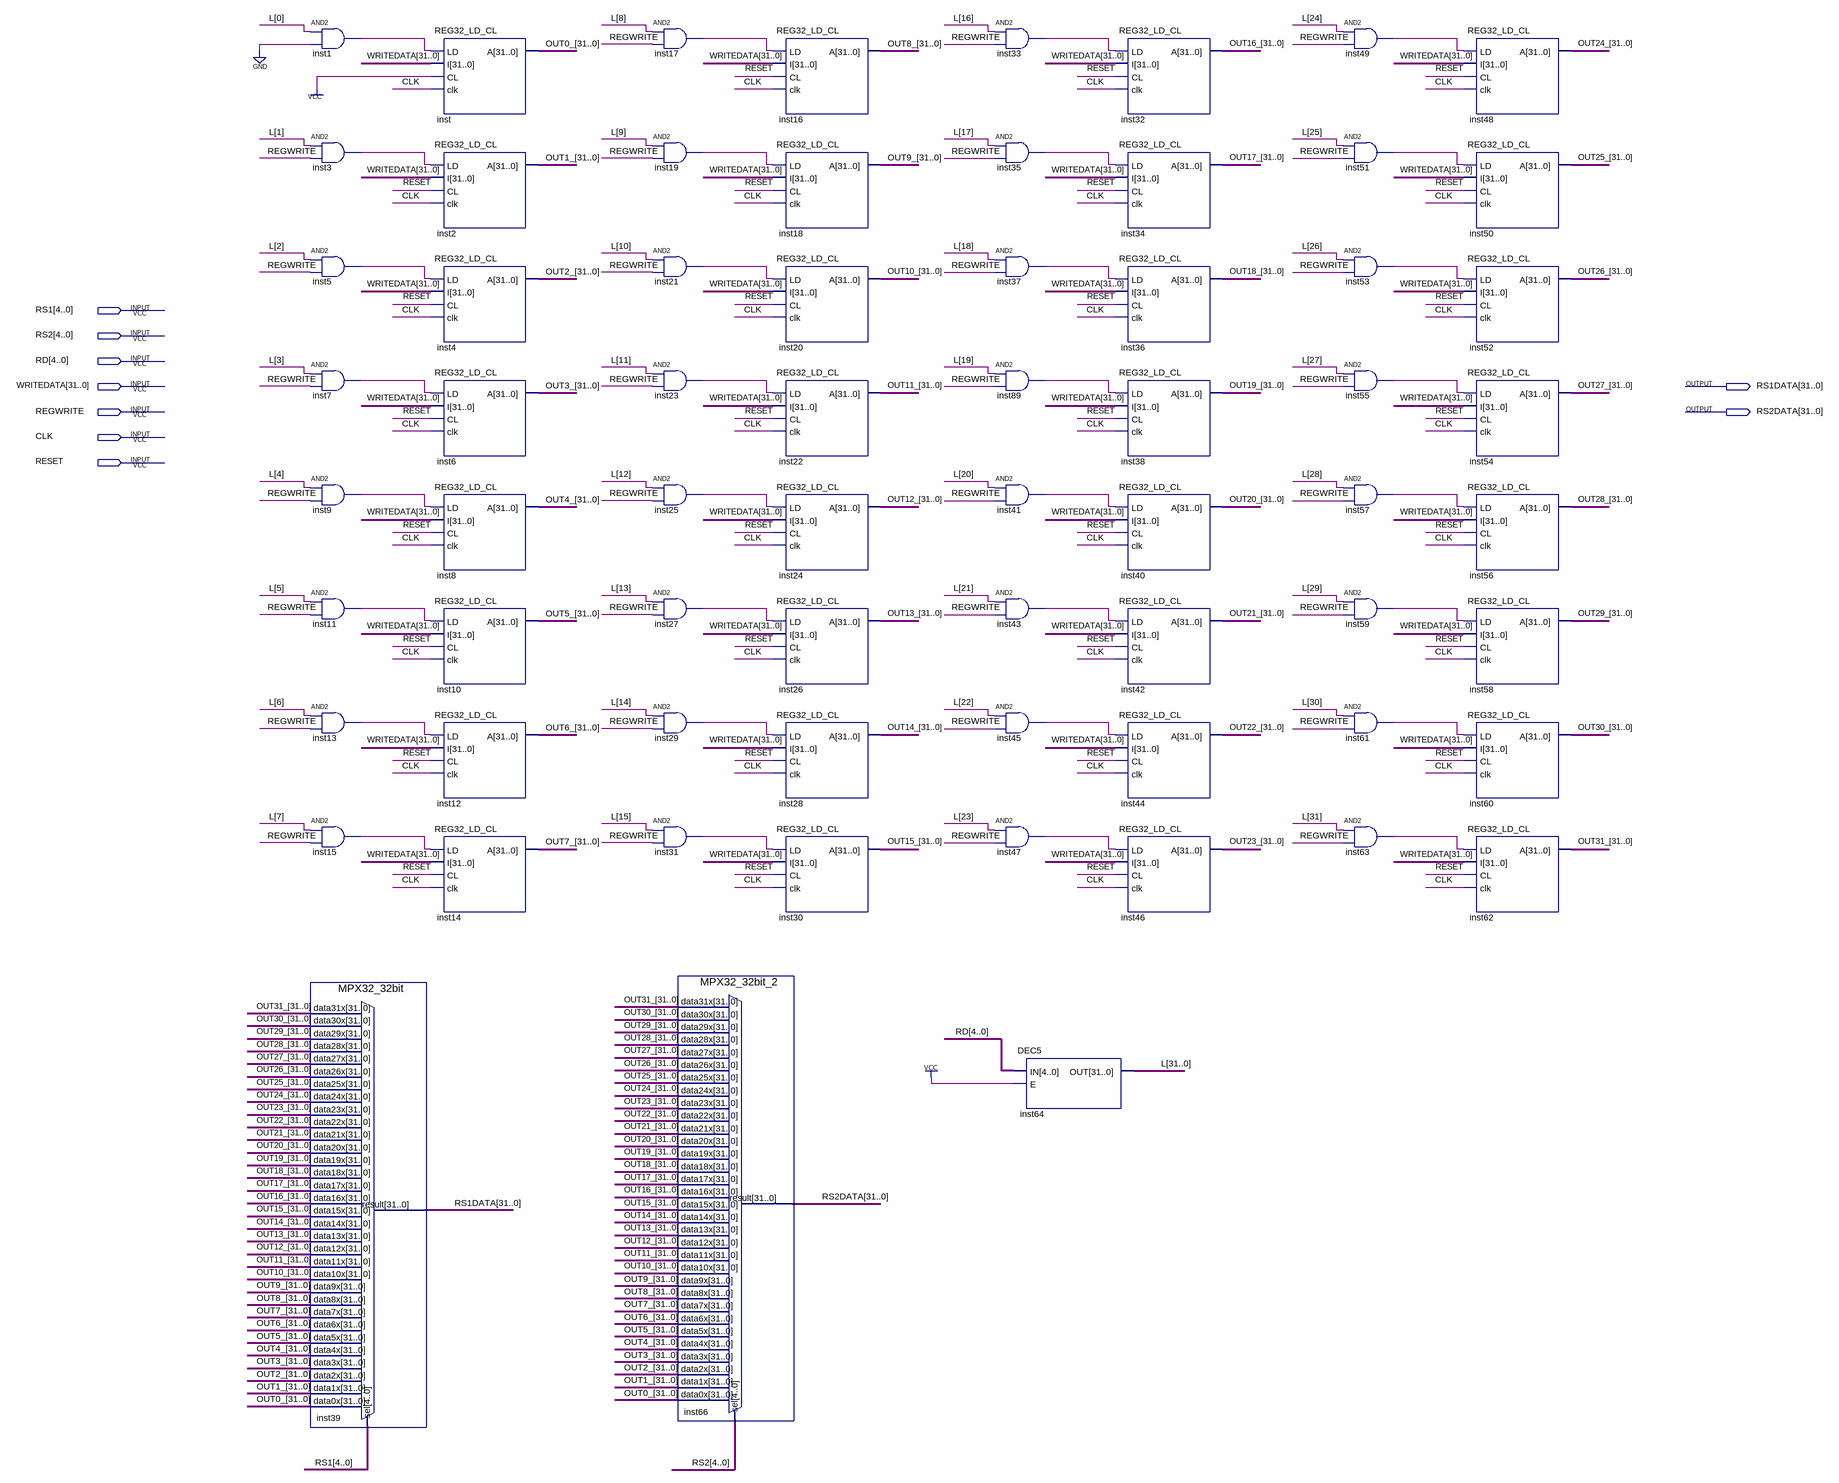
[diagram p0: schematic sheet]
// Quartus schematic REGFILE.bdf as structural Verilog: 67 symbols, 9 pins
module REGFILE (
  input  [4:0] RS1,
  input  [4:0] RS2,
  input  [4:0] RD,
  input  [31:0] WRITEDATA,
  input  REGWRITE,
  input  CLK,
  input  RESET,
  output [31:0] RS1DATA,
  output [31:0] RS2DATA
);

  wire inst1_out, inst3_out, inst5_out, inst7_out, inst9_out, inst11_out, inst13_out, inst15_out, inst17_out,
       inst19_out, inst21_out, inst23_out, inst25_out, inst27_out, inst29_out, inst31_out, inst33_out,
       inst35_out, inst37_out, inst41_out, inst43_out, inst45_out, inst47_out, inst49_out, inst51_out,
       inst53_out, inst55_out, inst57_out, inst59_out, inst61_out, inst63_out, inst89_out;
  wire [31:0] L, OUT0_, OUT1_, OUT2_, OUT3_, OUT4_, OUT5_, OUT6_, OUT7_, OUT8_, OUT9_, OUT10_, OUT11_,
       OUT12_, OUT13_, OUT14_, OUT15_, OUT16_, OUT17_, OUT18_, OUT19_, OUT20_, OUT21_, OUT22_, OUT23_,
       OUT24_, OUT25_, OUT26_, OUT27_, OUT28_, OUT29_, OUT30_, OUT31_;

  and inst1 (inst1_out, L[0], 1'b0);
  and inst3 (inst3_out, L[1], REGWRITE);
  and inst5 (inst5_out, L[2], REGWRITE);
  and inst7 (inst7_out, L[3], REGWRITE);
  and inst9 (inst9_out, L[4], REGWRITE);
  and inst11 (inst11_out, L[5], REGWRITE);
  and inst13 (inst13_out, L[6], REGWRITE);
  and inst15 (inst15_out, L[7], REGWRITE);
  MPX32_32bit inst39 (
    .data31x(OUT31_), .data30x(OUT30_), .data29x(OUT29_), .data28x(OUT28_), .data27x(OUT27_),
    .data26x(OUT26_), .data25x(OUT25_), .data24x(OUT24_), .data23x(OUT23_), .data22x(OUT22_),
    .data21x(OUT21_), .data20x(OUT20_), .data19x(OUT19_), .data18x(OUT18_), .data17x(OUT17_),
    .data16x(OUT16_), .data15x(OUT15_), .data14x(OUT14_), .data13x(OUT13_), .data12x(OUT12_),
    .data11x(OUT11_), .data10x(OUT10_), .data9x(OUT9_), .data8x(OUT8_), .data7x(OUT7_), .data6x(OUT6_),
    .data5x(OUT5_), .data4x(OUT4_), .data3x(OUT3_), .data2x(OUT2_), .data1x(OUT1_), .data0x(OUT0_),
    .sel(RS1), .result(RS1DATA));
  REG32_LD_CL inst (.LD(inst1_out), .I(WRITEDATA), .CL(1'b1), .clk(CLK), .A(OUT0_));
  REG32_LD_CL inst2 (.LD(inst3_out), .I(WRITEDATA), .CL(RESET), .clk(CLK), .A(OUT1_));
  REG32_LD_CL inst4 (.LD(inst5_out), .I(WRITEDATA), .CL(RESET), .clk(CLK), .A(OUT2_));
  REG32_LD_CL inst6 (.LD(inst7_out), .I(WRITEDATA), .CL(RESET), .clk(CLK), .A(OUT3_));
  REG32_LD_CL inst8 (.LD(inst9_out), .I(WRITEDATA), .CL(RESET), .clk(CLK), .A(OUT4_));
  REG32_LD_CL inst10 (.LD(inst11_out), .I(WRITEDATA), .CL(RESET), .clk(CLK), .A(OUT5_));
  REG32_LD_CL inst12 (.LD(inst13_out), .I(WRITEDATA), .CL(RESET), .clk(CLK), .A(OUT6_));
  REG32_LD_CL inst14 (.LD(inst15_out), .I(WRITEDATA), .CL(RESET), .clk(CLK), .A(OUT7_));
  and inst17 (inst17_out, L[8], REGWRITE);
  and inst19 (inst19_out, L[9], REGWRITE);
  and inst21 (inst21_out, L[10], REGWRITE);
  and inst23 (inst23_out, L[11], REGWRITE);
  and inst25 (inst25_out, L[12], REGWRITE);
  and inst27 (inst27_out, L[13], REGWRITE);
  and inst29 (inst29_out, L[14], REGWRITE);
  and inst31 (inst31_out, L[15], REGWRITE);
  MPX32_32bit_2 inst66 (
    .data31x(OUT31_), .data30x(OUT30_), .data29x(OUT29_), .data28x(OUT28_), .data27x(OUT27_),
    .data26x(OUT26_), .data25x(OUT25_), .data24x(OUT24_), .data23x(OUT23_), .data22x(OUT22_),
    .data21x(OUT21_), .data20x(OUT20_), .data19x(OUT19_), .data18x(OUT18_), .data17x(OUT17_),
    .data16x(OUT16_), .data15x(OUT15_), .data14x(OUT14_), .data13x(OUT13_), .data12x(OUT12_),
    .data11x(OUT11_), .data10x(OUT10_), .data9x(OUT9_), .data8x(OUT8_), .data7x(OUT7_), .data6x(OUT6_),
    .data5x(OUT5_), .data4x(OUT4_), .data3x(OUT3_), .data2x(OUT2_), .data1x(OUT1_), .data0x(OUT0_),
    .sel(RS2), .result(RS2DATA));
  REG32_LD_CL inst16 (.LD(inst17_out), .I(WRITEDATA), .CL(RESET), .clk(CLK), .A(OUT8_));
  REG32_LD_CL inst18 (.LD(inst19_out), .I(WRITEDATA), .CL(RESET), .clk(CLK), .A(OUT9_));
  REG32_LD_CL inst20 (.LD(inst21_out), .I(WRITEDATA), .CL(RESET), .clk(CLK), .A(OUT10_));
  REG32_LD_CL inst22 (.LD(inst23_out), .I(WRITEDATA), .CL(RESET), .clk(CLK), .A(OUT11_));
  REG32_LD_CL inst24 (.LD(inst25_out), .I(WRITEDATA), .CL(RESET), .clk(CLK), .A(OUT12_));
  REG32_LD_CL inst26 (.LD(inst27_out), .I(WRITEDATA), .CL(RESET), .clk(CLK), .A(OUT13_));
  REG32_LD_CL inst28 (.LD(inst29_out), .I(WRITEDATA), .CL(RESET), .clk(CLK), .A(OUT14_));
  REG32_LD_CL inst30 (.LD(inst31_out), .I(WRITEDATA), .CL(RESET), .clk(CLK), .A(OUT15_));
  and inst33 (inst33_out, L[16], REGWRITE);
  and inst35 (inst35_out, L[17], REGWRITE);
  and inst37 (inst37_out, L[18], REGWRITE);
  and inst89 (inst89_out, L[19], REGWRITE);
  and inst41 (inst41_out, L[20], REGWRITE);
  and inst43 (inst43_out, L[21], REGWRITE);
  and inst45 (inst45_out, L[22], REGWRITE);
  and inst47 (inst47_out, L[23], REGWRITE);
  DEC5 inst64 (.IN(RD), .E(1'b1), .OUT(L));
  REG32_LD_CL inst32 (.LD(inst33_out), .I(WRITEDATA), .CL(RESET), .clk(CLK), .A(OUT16_));
  REG32_LD_CL inst34 (.LD(inst35_out), .I(WRITEDATA), .CL(RESET), .clk(CLK), .A(OUT17_));
  REG32_LD_CL inst36 (.LD(inst37_out), .I(WRITEDATA), .CL(RESET), .clk(CLK), .A(OUT18_));
  REG32_LD_CL inst38 (.LD(inst89_out), .I(WRITEDATA), .CL(RESET), .clk(CLK), .A(OUT19_));
  REG32_LD_CL inst40 (.LD(inst41_out), .I(WRITEDATA), .CL(RESET), .clk(CLK), .A(OUT20_));
  REG32_LD_CL inst42 (.LD(inst43_out), .I(WRITEDATA), .CL(RESET), .clk(CLK), .A(OUT21_));
  REG32_LD_CL inst44 (.LD(inst45_out), .I(WRITEDATA), .CL(RESET), .clk(CLK), .A(OUT22_));
  REG32_LD_CL inst46 (.LD(inst47_out), .I(WRITEDATA), .CL(RESET), .clk(CLK), .A(OUT23_));
  and inst49 (inst49_out, L[24], REGWRITE);
  and inst51 (inst51_out, L[25], REGWRITE);
  and inst53 (inst53_out, L[26], REGWRITE);
  and inst55 (inst55_out, L[27], REGWRITE);
  and inst57 (inst57_out, L[28], REGWRITE);
  and inst59 (inst59_out, L[29], REGWRITE);
  and inst61 (inst61_out, L[30], REGWRITE);
  and inst63 (inst63_out, L[31], REGWRITE);
  REG32_LD_CL inst48 (.LD(inst49_out), .I(WRITEDATA), .CL(RESET), .clk(CLK), .A(OUT24_));
  REG32_LD_CL inst50 (.LD(inst51_out), .I(WRITEDATA), .CL(RESET), .clk(CLK), .A(OUT25_));
  REG32_LD_CL inst52 (.LD(inst53_out), .I(WRITEDATA), .CL(RESET), .clk(CLK), .A(OUT26_));
  REG32_LD_CL inst54 (.LD(inst55_out), .I(WRITEDATA), .CL(RESET), .clk(CLK), .A(OUT27_));
  REG32_LD_CL inst56 (.LD(inst57_out), .I(WRITEDATA), .CL(RESET), .clk(CLK), .A(OUT28_));
  REG32_LD_CL inst58 (.LD(inst59_out), .I(WRITEDATA), .CL(RESET), .clk(CLK), .A(OUT29_));
  REG32_LD_CL inst60 (.LD(inst61_out), .I(WRITEDATA), .CL(RESET), .clk(CLK), .A(OUT30_));
  REG32_LD_CL inst62 (.LD(inst63_out), .I(WRITEDATA), .CL(RESET), .clk(CLK), .A(OUT31_));
endmodule
